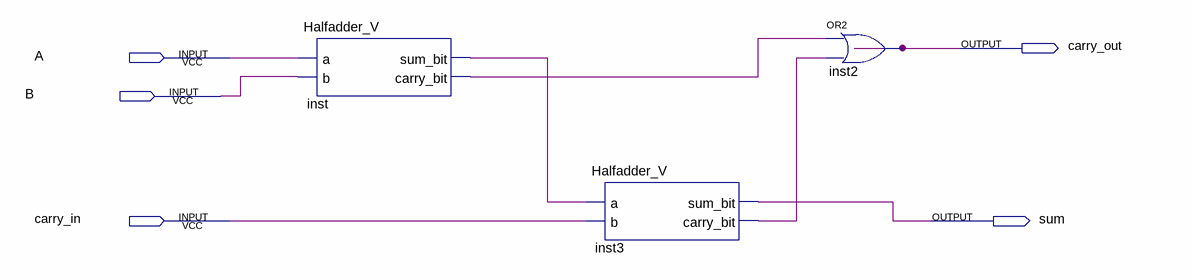
[diagram p0: schematic sheet]
// Quartus schematic Fulladder.bdf as structural Verilog: 3 symbols, 5 pins
module Fulladder (
  input  A,
  input  B,
  input  carry_in,
  output carry_out,
  output sum
);

  wire inst3_carry_bit, inst_carry_bit, inst_sum_bit;

  Halfadder_V inst (.a(A), .b(B), .sum_bit(inst_sum_bit), .carry_bit(inst_carry_bit));
  Halfadder_V inst3 (.a(inst_sum_bit), .b(carry_in), .sum_bit(sum), .carry_bit(inst3_carry_bit));
  or inst2 (carry_out, inst_carry_bit, inst3_carry_bit);
endmodule
